# EAGLE design tdz (EAGLE 6.4)
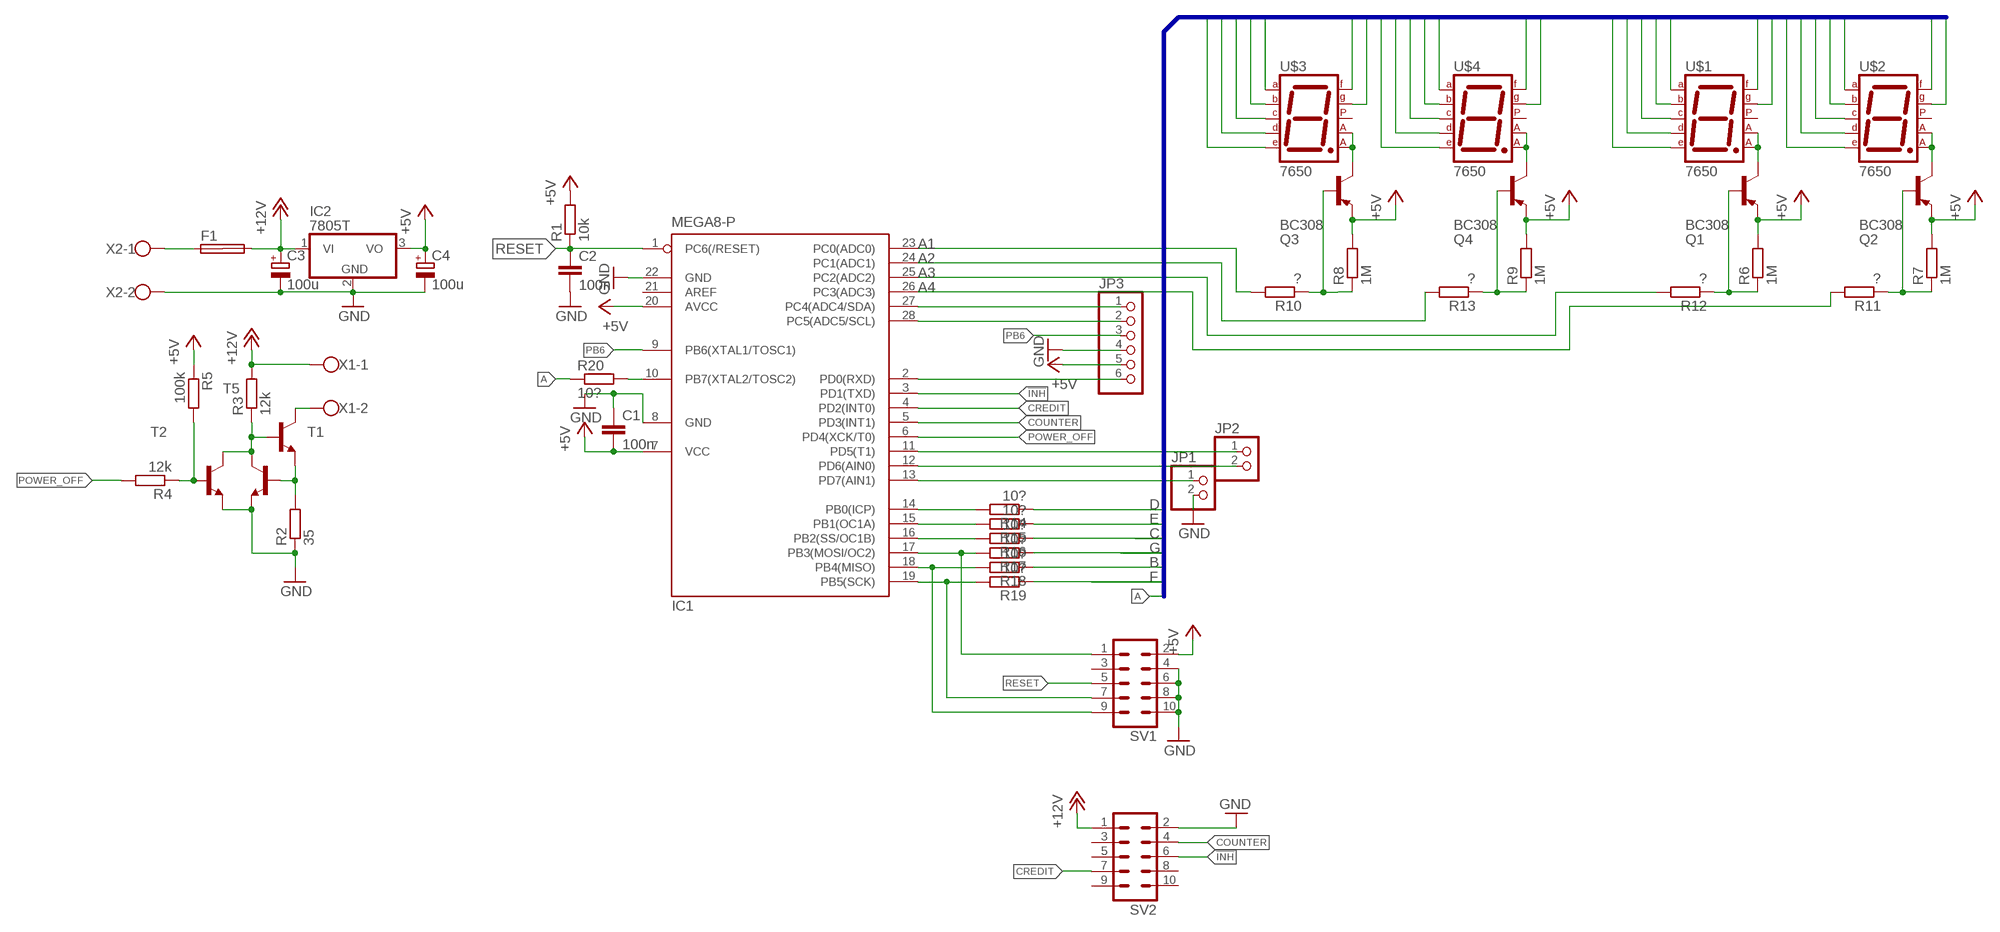
[diagram p0: schematic, sheet 1]

## Parts
C1  100n  C-EUC0603  [C0603]
C2  100n  C-EUC0603  [C0603]
C3  100u  CPOL-EUE22-9AXIAL  [E22-9]
C4  100u  CPOL-EUE22-9AXIAL  [E22-9]
F1  SHK20Q  [SHK20Q]
IC1  MEGA8-P  [DIL28-3]
IC2  7805T  [TO220H]
JP1  PINHD-1X02_2.54-S  [1X02-S]
JP2  PINHD-1X02_2.54-S  [1X02-S]
JP3  PINHD-1X6  [1X06]
Q1  BC308  BCX79  [TO92-EBC]
Q2  BC308  BCX79  [TO92-EBC]
Q3  BC308  BCX79  [TO92-EBC]
Q4  BC308  BCX79  [TO92-EBC]
R1  10k  R-EU_R0603  [R0603]
R2  35  R-EU_R0603  [R0603]
R3  12k  R-EU_R0603  [R0603]
R4  12k  R-EU_R0603  [R0603]
R5  100k  R-EU_R0603  [R0603]
R6  1M  R-EU_R0603  [R0603]
R7  1M  R-EU_R0603  [R0603]
R8  1M  R-EU_R0603  [R0603]
R9  1M  R-EU_R0603  [R0603]
R10  ?  R-EU_0207/7  [0207/7]
R11  ?  R-EU_0207/7  [0207/7]
R12  ?  R-EU_0207/7  [0207/7]
R13  ?  R-EU_0207/7  [0207/7]
R14  10?  R-EU_R0603  [R0603]
R15  10?  R-EU_R0603  [R0603]
R16  10?  R-EU_R0603  [R0603]
R17  10?  R-EU_R0603  [R0603]
R18  10?  R-EU_R0603  [R0603]
R19  10?  R-EU_R0603  [R0603]
R20  10?  R-EU_R0603  [R0603]
SV1  ML10L  [ML10L]
SV2  ML10L  [ML10L]
T1  BC548-NPN-TO92-CBE  [TO92-CBE]
T2  BC548-NPN-TO92-CBE  [TO92-CBE]
T5  BC548-NPN-TO92-CBE  [TO92-CBE]
U$1  7650  [7650]
U$2  7650  [7650]
U$3  7650  [7650]
U$4  7650  [7650]
X1  W237-102  [W237-102]
X2  W237-102  [W237-102]

## Nets
!INH!: IC1.3(PD1(TXD)) SV2.6
+5V: C1.2 C4.+ IC1.7(VCC) IC1.20(AVCC) IC2.3(VO) JP3.5 Q1.E Q2.E Q3.E Q4.E R1.2 R5.1 R6.2 R7.2 R8.2 R9.2 SV1.2
+12V: C3.+ F1.2A IC2.1(VI) R3.2 SV2.1 X1.1
A: R20.1 U$1.P$1(A) U$2.P$1(A) U$3.P$1(A) U$4.P$1(A)
A1: IC1.23(PC0(ADC0)) R10.2
A2: IC1.24(PC1(ADC1)) R13.2
A3: IC1.25(PC2(ADC2)) R12.2
A4: IC1.26(PC3(ADC3)) R11.2
B: R18.1 U$1.P$13(B) U$2.P$13(B) U$3.P$13(B) U$4.P$13(B)
C: R16.1 U$1.P$10(C) U$2.P$10(C) U$3.P$10(C) U$4.P$10(C)
COUNTER: IC1.5(PD3(INT1)) SV2.4
CREDIT: IC1.4(PD2(INT0)) SV2.7
D: R14.1 U$1.P$8(D) U$2.P$8(D) U$3.P$8(D) U$4.P$8(D)
E: R15.1 U$1.P$7(E) U$2.P$7(E) U$3.P$7(E) U$4.P$7(E)
F: R19.1 U$1.P$2(F) U$2.P$2(F) U$3.P$2(F) U$4.P$2(F)
G: R17.1 U$1.P$11(G) U$2.P$11(G) U$3.P$11(G) U$4.P$11(G)
GND: C1.1 C2.2 C3.- C4.- IC1.8(GND) IC1.22(GND) IC2.2(GND) JP1.2 JP3.4 R2.1 SV1.4 SV1.6 SV1.8 SV1.10 SV2.2 T1.E T2.E X2.2
N$1: Q1.C U$1.P$3(CA1) U$1.P$14(CA2)
N$2: Q2.C U$2.P$3(CA1) U$2.P$14(CA2)
N$3: Q3.C U$3.P$3(CA1) U$3.P$14(CA2)
N$4: Q4.C U$4.P$3(CA1) U$4.P$14(CA2)
N$5: Q4.B R9.1 R13.1
N$6: Q3.B R8.1 R10.1
N$7: Q2.B R7.1 R11.1
N$8: Q1.B R6.1 R12.1
N$9: T5.C X1.2
N$10: IC1.13(PD7(AIN1)) JP1.1
N$11: IC1.12(PD6(AIN0)) JP2.2
N$12: R2.2 T1.B T5.E
N$13: IC1.11(PD5(T1)) JP2.1
N$14: R3.1 T1.C T2.C T5.B
N$15: R4.1 R5.2 T2.B
N$142: IC1.10(PB7(XTAL2/TOSC2)) R20.2
N$143: IC1.14(PB0(ICP)) R14.2
N$144: IC1.15(PB1(OC1A)) R15.2
N$145: IC1.16(PB2(SS/OC1B)) R16.2
N$146: IC1.18(PB4(MISO)) R18.2 SV1.9
N$147: IC1.19(PB5(SCK)) R19.2 SV1.7
N$148: IC1.17(PB3(MOSI/OC2)) R17.2 SV1.1
N$149: IC1.27(PC4(ADC4/SDA)) JP3.1
N$150: IC1.28(PC5(ADC5/SCL)) JP3.2
N$151: IC1.2(PD0(RXD)) JP3.6
N$152: F1.1A X2.1
PB6: IC1.9(PB6(XTAL1/TOSC1)) JP3.3
POWER_OFF: IC1.6(PD4(XCK/T0)) R4.2
RESET: C2.1 IC1.1(PC6(/RESET)) R1.1 SV1.5
Unconnected: F1.1B F1.2B IC1.21(AREF) SV1.3 SV2.3 SV2.5 SV2.8 SV2.9 SV2.10 U$1.P$6(DP) U$2.P$6(DP) U$3.P$6(DP) U$4.P$6(DP)

## Buses
A,B,C,D,E,F,G

## Library data of the parts
C1 C2 = rcl:C-EU: CAPACITOR, European symbol
C3 C4 = rcl:CPOL-EU: POLARIZED CAPACITOR, European symbol
F1 = fuse:SHK20Q: FUSE HOLDER 5 x 20 mm, SH contact, E1207 Buerklin 64G6061
IC1 = atmel:MEGA8-P: MICROCONTROLLER 8 Kbytes FLASH, 1 kbytes SRAM, 512 bytes EEPROM, USART, 4-channel 10 bit ADC, 2-channel 8 bit ADC Pin compatible with Atmega48, ATMega88, ATMega168 Source: avr.lbr; OC_FARNELL: unknown; OC_NEWARK: unknown
IC2 = linear:78*: Positive VOLTAGE REGULATOR Source: http://cache.national.com/ds/LM/LM78L05.pdf http://www.fairchildsemi.com/ds/LM/LM7805.pdf
JP1 JP2 = pinhead-2:PINHD-1X02: PIN HEADER
JP3 = pinhead:PINHD-1X6: PIN HEADER
Q1-Q4 = transistor-pnp:BCX79*: PNP Transistror
R1-R20 = rcl:R-EU_: RESISTOR, European symbol
SV1 SV2 = con-harting-ml:ML10: HARTING; OC_FARNELL: unknown; OC_NEWARK: unknown
T1 T2 T5 = transistor:*-NPN-: NPN Transistror BF959 corrected 2008.03.06
U$1-U$4 = 7650:7650
X1 X2 = con-wago-500:W237-102: WAGO SCREW CLAMP

## Board
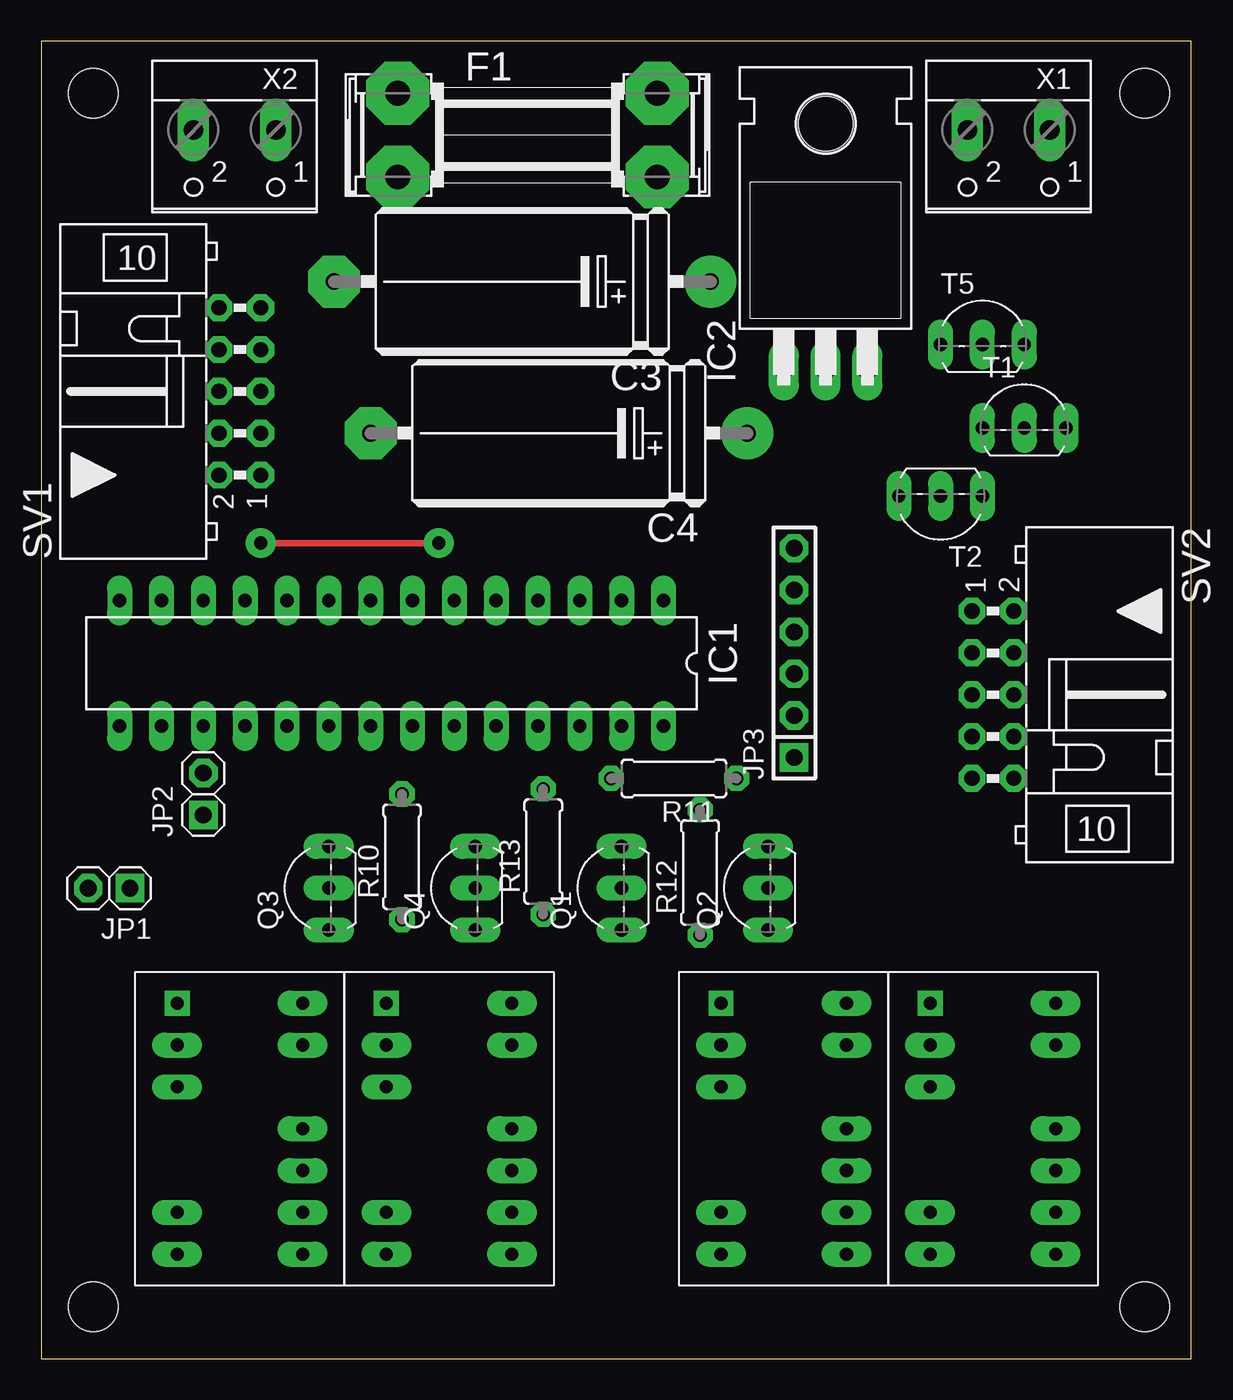
[diagram p1: board, top side]
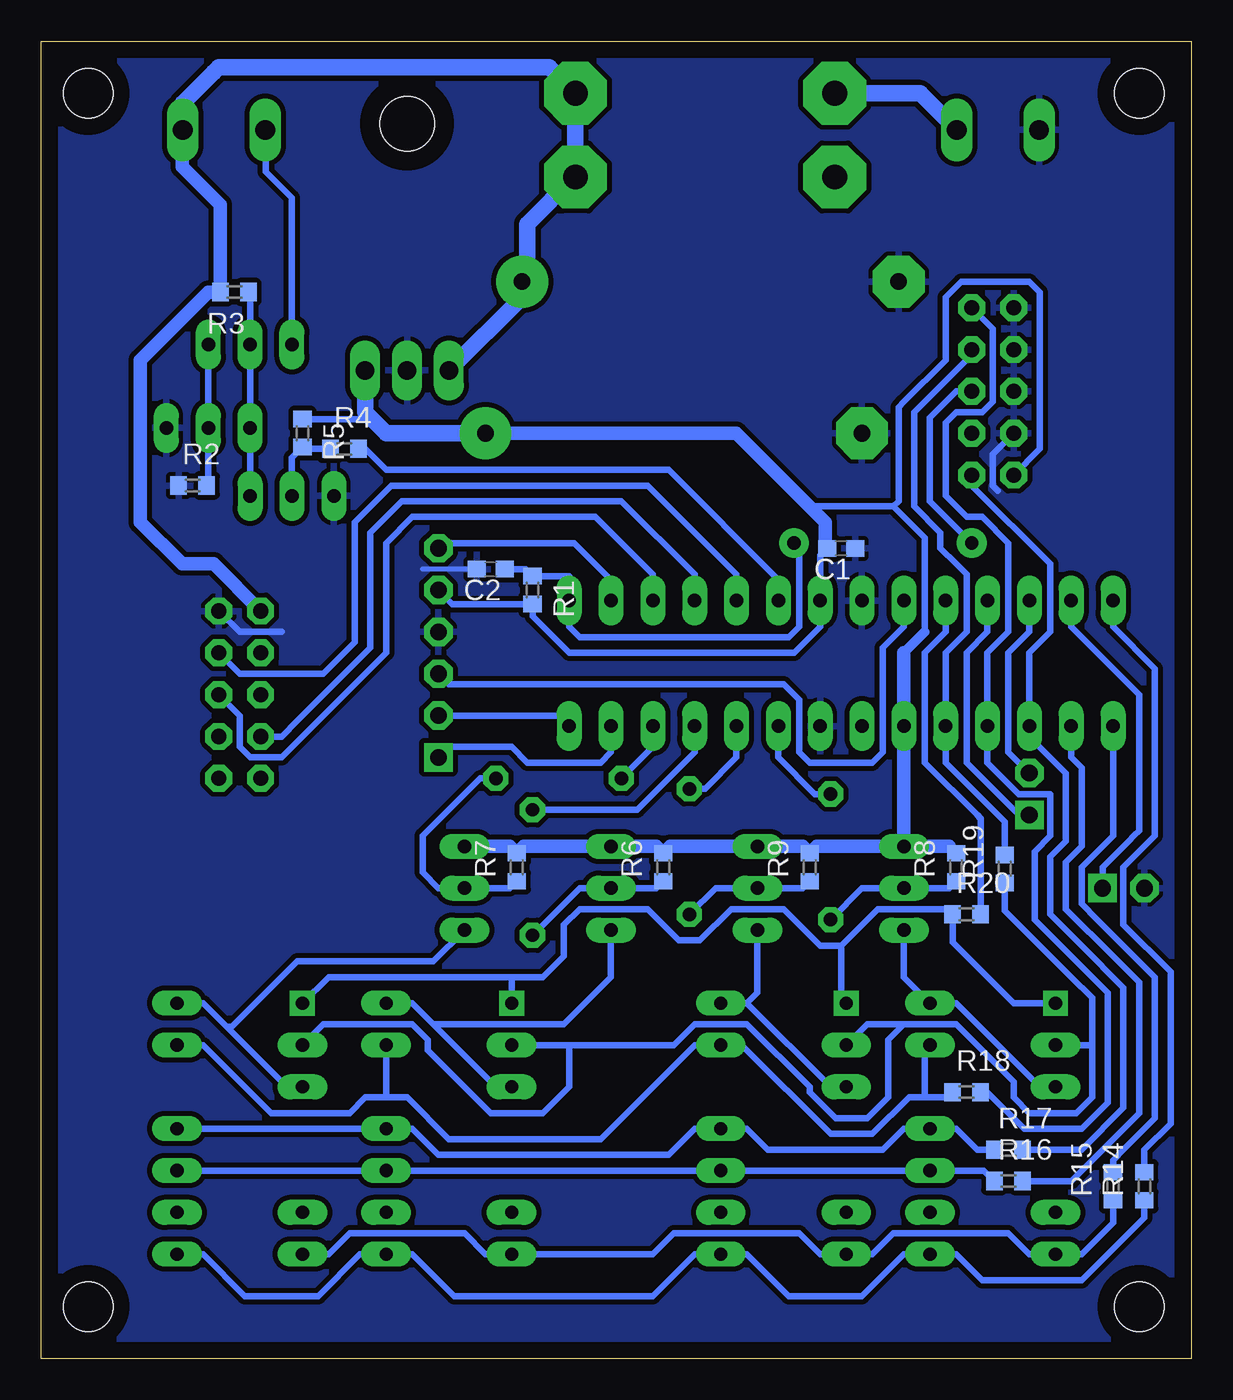
[diagram p2: board, bottom side, seen from below]

Size 69.84 x 80 mm. Coordinates in mm from the lower left corner, seen from the top.
Outline: 0,0 69.84,0 69.84,80 0,80 0,0
Copper layers (1*16): Top 0.035mm / dielectric 1.5mm / Bottom 0.035mm
Design rules "default *": minimum track width 10mil, minimum drill 24mil, track to track 12mil, track to pad 12mil, pad to pad 12mil, via to via 12mil, smd to smd 0mil, copper to edge 40mil, drill to drill 8mil, minimum pad ring 14mil, minimum via ring 20mil, stop-mask expansion 4mil, vias tented up to drill 0mil, thermal gap 10mil
Holes 3 mm at 3.17,76.83 3.17,3.17 66.99,3.17 66.99,76.83

### Footprints (pad centres in the part's own frame; a part is rotated, then mirrored left to right if it is on the bottom)
C0603 = smd 1.1 x 1: 1 -0.85,0; 2 0.85,0
E22-9 = drill 1.016 pad 3.15: + -11.43,0 | drill 1.016 pad 3.15 octagon: - 11.43,0
SHK20Q = drill 1.5 pad 3.81 octagon: 1A -7.874,2.54; 1B -7.874,-2.54; 2A 7.874,2.54; 2B 7.874,-2.54
DIL28-3 = drill 0.813 long: 1 -16.51,-3.81; 2 -13.97,-3.81; 3 -11.43,-3.81; 4 -8.89,-3.81; 5 -6.35,-3.81; 6 -3.81,-3.81; 7 -1.27,-3.81; 8 1.27,-3.81; 9 3.81,-3.81; 10 6.35,-3.81; 11 8.89,-3.81; 12 11.43,-3.81; 13 13.97,-3.81; 14 16.51,-3.81; 15 16.51,3.81; 16 13.97,3.81; 17 11.43,3.81; 18 8.89,3.81; 19 6.35,3.81; 20 3.81,3.81; 21 1.27,3.81; 22 -1.27,3.81; 23 -3.81,3.81; 24 -6.35,3.81; 25 -8.89,3.81; 26 -11.43,3.81; 27 -13.97,3.81; 28 -16.51,3.81
TO220H = drill 1.118 long: 1 -2.54,-10.16; 2 0,-10.16; 3 2.54,-10.16 | hole 3.302: 0,4.826
1X02-S = drill 1.016 square: 1 -1.27,0 | drill 1.016 octagon: 2 1.27,0
1X06 = drill 1.016 square: 1 -6.35,0 | drill 1.016 octagon: 2 -3.81,0; 3 -1.27,0; 4 1.27,0; 5 3.81,0; 6 6.35,0
TO92-EBC = drill 0.813 long: B 0,-1.27; C -2.54,-1.27; E 2.54,-1.27
R0603 = smd 1 x 1.1: 1 -0.85,0; 2 0.85,0
0207/7 = drill 0.813 octagon: 1 -3.81,0; 2 3.81,0
ML10L = drill 0.914 octagon: 1 -5.08,-1.27; 2 -5.08,1.27; 3 -2.54,-1.27; 4 -2.54,1.27; 5 0,-1.27; 6 0,1.27; 7 2.54,-1.27; 8 2.54,1.27; 9 5.08,-1.27; 10 5.08,1.27
TO92-CBE = drill 0.813 long: B 0,0; C -2.54,0; E 2.54,0
7650 = drill 0.8 square: P$1 -3.81,7.62 | drill 0.8 long: P$2 -3.81,5.08; P$3 -3.81,2.54; P$6 -3.81,-5.08; P$7 -3.81,-7.62; P$8 3.81,-7.62; P$9 3.81,-5.08; P$10 3.81,-2.54; P$11 3.81,0; P$13 3.81,5.08; P$14 3.81,7.62
W237-102 = drill 1.194 long: 1 -2.5,-1.27; 2 2.5,-1.27

### Placement (x,y rotation side)
C1  21.27,49.21 180 bottom
C2  42.55,47.94 180 bottom
C3  29.21,65.41 180 top
C4  31.43,56.2 180 top
F1  29.53,74.3 0 top
IC1  21.27,42.23 180 top
IC2  47.62,70.17 0 top
JP1  4.13,28.57 180 top
JP2  9.84,34.29 90 top
JP3  45.72,42.86 90 top
Q1  33.97,28.57 90 top
Q2  42.86,28.57 90 top
Q3  16.19,28.57 90 top
Q4  25.08,28.57 90 top
R1  40.01,46.67 270 bottom
R2  60.64,53.02 0 bottom
R3  58.1,64.77 180 bottom
R4  51.44,55.24 0 bottom
R5  53.98,56.2 270 bottom
R6  32.07,29.84 90 bottom
R7  40.96,29.84 90 bottom
R8  14.29,29.84 90 bottom
R9  23.18,29.84 90 bottom
R10  21.91,30.48 90 top
R11  38.42,35.24 180 top
R12  40.01,29.53 90 top
R13  30.48,30.8 90 top
R14  2.86,10.48 90 bottom
R15  4.76,10.48 90 bottom
R16  11.11,10.79 0 bottom
R17  11.11,12.7 0 bottom
R18  13.65,16.19 0 bottom
R19  11.34,29.75 90 bottom
R20  13.65,26.99 0 bottom
SV1  12.06,58.74 90 top
SV2  57.78,40.32 270 top
T1  59.69,56.52 0 top
T2  54.61,52.39 180 top
T5  57.15,61.59 0 top
U$1  45.09,13.97 0 top
U$2  57.78,13.97 0 top
U$3  12.06,13.97 0 top
U$4  24.77,13.97 0 top
X1  58.74,73.34 180 top
X2  11.75,73.34 180 top

### Tracks (layer width: path | path; a pad name or v marks a point on that pad's centre or on a via)
!INH!
  Bottom 0.406: IC1.3 32.7,47.62 36.2,51.12 47.31,51.12 48.9,49.53 48.9,42.86 53.34,38.42 55.24,36.51 57.15,36.51 57.78,37.15 57.78,39.05 SV2.6
+5V
  Bottom 0.406: R8.2 14.71,31.11 | 16.19,44.13 16.19,49.21 16.19,49.85 17.78,51.44 18.1,51.75 | 21.91,49.21 C1.2 22.54,48.79 IC1.7 22.54,44.45 24.13,42.86 37.78,42.86 40.01,45.09 R1.2 44.87,45.82 JP3.5 | R5.1 49.74,57.05 48.9,56.2 | SV1.2 9.21,55.24 9.21,64.77 9.84,65.41 13.97,65.41 14.92,64.45 14.92,60.64 17.46,58.1 17.78,57.78 17.78,52.07 18.1,51.75 | 18.1,51.75 22.86,51.75 23.02,51.59
  Bottom 0.61: 17.46,42.86 16.19,44.13
  Bottom 0.813: 14.71,31.11 Q3.E | Q3.E IC1.20 17.46,42.86 | Q2.E 41.38,31.11 R7.2 40.54,31.11 Q1.E 32.49,31.11 R6.2 31.65,31.11 Q4.E 23.6,31.11 R9.2 22.76,31.11 Q3.E | C4.+ 27.62,56.2 23.02,51.59 22.23,50.8 22.23,49.31 C1.2
  Bottom 1.016: C4.+ 48.9,56.2 50.16,57.47 IC2.3
+12V
  Bottom 0.406: 61.28,74.57 X1.1
  Bottom 0.813: 61.28,73.7 X1.1 61.24,76.24 | 61.28,74.57 61.28,72.71 61.28,72.39 58.95,70.06 R3.2 59.69,64.77 63.82,60.64 63.82,50.8 61.28,48.26 59.37,48.26 SV2.1 | 37.47,71.75 37.4,71.82
  Bottom 1.016: 61.24,76.24 59.37,78.11 59.05,78.42 38.99,78.42 F1.2A 37.4,71.82 | 37.47,71.75 40.32,68.9 40.32,65.72 C3.+ 40.64,64.45 IC2.1
A
  Bottom 0.406: U$1.P$1 41.27,22.86 | 41.27,22.86 41.27,23.18 | U$2.P$1 52.39,23.18 41.27,23.18 | 41.27,23.18 39.37,23.18 38.73,23.81 38.1,24.45 38.1,26.35 37.15,27.3 33.02,27.3 31.11,25.4 29.84,25.4 27.94,27.3 26.35,27.3 24.77,27.3 22.54,25.08 21.27,25.08 | 41.27,23.18 41.27,22.86 | 21.27,25.08 19.05,27.3 14.82,27.3 R20.1 14.5,25.3 14.29,25.08 10.79,21.59 U$3.P$1 | 21.27,25.08 21.27,21.91 U$4.P$1
A1
  Bottom 0.406: R10.2 22.86,34.29 25.08,36.51 IC1.23
A2
  Bottom 0.406: R13.2 29.53,34.61 27.62,36.51 IC1.24
A3
  Bottom 0.406: R12.2 33.66,33.34 30.16,36.83 IC1.25
A4
  Bottom 0.406: IC1.26 32.7,37.15 R11.2
B
  Bottom 0.406: U$2.P$13 60.01,19.05 55.88,14.92 51.12,14.92 50.16,15.88 48.9,15.88 | 16.19,15.88 17.14,15.88 19.37,13.65 21.91,13.65 27.3,19.05 U$4.P$13 30.16,19.05 35.88,13.34 41.59,13.34 45.09,13.34 47.62,15.88 48.9,15.88 | 16.19,15.88 16.19,18.73 U$3.P$13 | U$1.P$13 48.9,15.88 | 16.19,15.88 14.82,15.88 R18.1
C
  Bottom 0.406: U$2.P$10 U$1.P$10 U$4.P$10 U$3.P$10 12.6,11.43 R16.1
COUNTER
  Bottom 0.406: IC1.5 27.62,47.62 33.02,53.02 48.58,53.02 50.8,50.8 50.8,43.5 52.7,41.59 55.88,41.59 57.78,41.59 SV2.4
CREDIT
  Bottom 0.406: IC1.4 30.16,47.62 34.61,52.07 47.94,52.07 49.85,50.16 49.85,43.18 54.29,38.73 55.24,37.78 55.56,37.78 SV2.7
D
  Bottom 0.406: U$2.P$8 60.01,6.35 57.47,3.81 53.02,3.81 50.48,6.35 U$1.P$8 47.31,6.35 44.77,3.81 32.7,3.81 30.16,6.35 U$4.P$8 26.99,6.35 24.45,3.81 20,3.81 17.46,6.35 U$3.P$8 14.29,6.35 12.7,4.76 6.67,4.76 2.86,8.57 R14.1
E
  Bottom 0.406: U$2.P$7 52.39,6.35 51.12,7.62 44.13,7.62 42.86,6.35 U$1.P$7 32.7,6.35 31.43,7.62 23.81,7.62 22.54,6.35 U$4.P$7 19.37,6.35 18.1,7.62 17.46,7.62 16.83,7.62 11.11,7.62 9.84,6.35 U$3.P$7 6.67,6.35 4.76,8.26 R15.1
F
  Bottom 0.406: U$4.P$2 19.68,20.32 17.46,20.32 | 17.46,20.32 14.29,20.32 10.79,16.83 10.79,15.88 9.84,14.92 6.99,14.92 6.03,15.88 6.03,19.05 | 17.46,20.32 18.41,19.37 18.41,15.88 19.68,14.61 21.59,14.61 23.18,16.19 23.18,16.51 26.99,20.32 30.16,20.32 31.43,19.05 37.78,19.05 | 37.78,19.05 U$1.P$2 | U$2.P$2 52.7,20.32 47.31,20.32 46.35,19.37 46.35,18.73 42.55,14.92 39.37,14.92 37.78,16.51 37.78,19.05 | U$3.P$2 6.03,19.05 | 6.03,19.05 6.03,21.91 7.3,23.18 11.34,27.21 R19.1
G
  Bottom 0.406: U$2.P$11 U$1.P$11 47.31,13.97 45.72,12.38 31.75,12.38 30.16,13.97 U$4.P$11 26.99,13.97 25.72,12.7 18.73,12.7 17.46,13.97 U$3.P$11 14.29,13.97 13.02,12.7 R17.1
GND
  Bottom 0.305: C2.2 46.67,47.94
  Bottom 0.406: SV2.2 57.78,44.13 55.24,44.13 | SV1.4 12.06,54.93 12.06,53.02 11.75,52.7
  pour Bottom (isolate 0.305): -1.27,82.55 -1.27,-1.27 71.44,-1.27 71.44,82.55
N$1
  Bottom 0.406: U$1.P$3 42.23,16.51 46.04,20.32 | 46.04,20.32 47.31,21.59 U$1.P$14 | Q1.C 35.24,23.18 38.1,20.32 46.04,20.32
N$2
  Bottom 0.406: U$2.P$3 54.93,16.51 58.58,20.16 | 58.58,20.16 60.01,21.59 U$2.P$14 | Q2.C 46.04,24.13 53.98,24.13 54.29,24.13 58.26,20.16 58.58,20.16
N$3
  Bottom 0.406: U$3.P$3 9.21,16.51 14.29,21.59 U$3.P$14 17.46,23.18 Q3.C
N$4
  Bottom 0.406: U$4.P$3 21.91,16.51 26.99,21.59 | 26.99,21.59 U$4.P$14 | 26.99,21.59 26.35,22.23 Q4.C
N$5
  Bottom 0.406: R9.1 23.6,28.57 Q4.B 28.89,28.57 R13.1
N$6
  Bottom 0.406: R8.1 14.71,28.57 Q3.B 20,28.57 R10.1
N$7
  Bottom 0.406: R7.1 41.38,28.57 Q2.B 45.72,28.57 46.67,29.53 46.67,31.75 43.18,35.24 R11.1
N$8
  Bottom 0.406: R6.1 32.49,28.57 Q1.B 37.15,28.57 R12.1
N$9
  Bottom 0.406: T5.C 54.61,70.48 56.2,72.07 56.2,74.57 X1.2
N$10
  Bottom 0.406: JP1.1 5.4,29.84 3.81,31.43 3.49,31.75 3.17,32.07 3.17,40.32 7.3,44.45 IC1.13
N$11
  Bottom 0.406: IC1.12 9.84,44.13 11.11,42.86 11.11,36.83 JP2.2
N$12
  Bottom 0.406: R2.2 59.69,53.12 T1.B T5.E
N$13
  Bottom 0.406: IC1.11 12.38,44.13 13.65,42.86 13.65,37.15 13.65,36.75 13.65,36.2 10.48,33.02 JP2.1
N$14
  Bottom 0.406: T2.C T1.C T5.B 57.15,64.67 R3.1
N$15
  Bottom 0.406: R4.1 53.87,55.24 R5.2 54.61,54.71 T2.B
N$142
  Bottom 0.406: IC1.10 14.92,44.13 16.19,42.86 16.19,36.2 13.02,33.02 12.8,32.8 R20.2
N$143
  Bottom 0.406: R14.2 2.86,12.7 1.27,14.29 1.27,23.5 4.13,26.35 4.13,29.84 2.86,31.11 2.22,31.75 2.22,41.91 4.76,44.45 IC1.14
N$144
  Bottom 0.406: R15.2 4.76,12.06 4.13,12.7 2.22,14.61 2.22,23.18 5.08,26.04 5.71,26.67 6.67,27.62 6.67,29.84 5.71,30.8 4.76,31.75 IC1.15
N$145
  Bottom 0.406: R16.2 7.3,10.79 6.03,12.06 3.17,14.92 3.17,22.86 6.03,25.72 6.35,26.04 7.62,27.3 7.62,30.16 6.67,31.11 6.67,31.43 6.67,35.88 7.3,36.51 IC1.16
N$146
  Bottom 0.406: R18.2 12.38,16.19 10.16,13.97 6.67,13.97 5.08,15.56 5.08,22.23 6.51,23.65 6.99,24.13 9.53,26.67 9.53,30.8 8.57,31.75 8.57,34.29 10.48,34.29 12.38,36.2 IC1.18 12.38,42.86 11.11,44.13 11.11,49.53 12.7,51.12 13.65,51.12 14.92,52.39 14.92,56.83 14.29,57.47 12.7,57.47 12.06,58.1 12.06,62.55 SV1.9
N$147
  Bottom 0.406: R19.2 11.34,32.61 14.92,36.2 IC1.19 14.92,42.86 13.65,44.13 13.65,47.62 14.29,48.26 15.24,49.21 15.24,50.16 16.83,51.75 16.83,57.47 13.34,60.96 SV1.7
N$148
  Bottom 0.406: R17.2 6.67,12.7 4.13,15.24 4.13,22.54 6.67,25.08 8.57,26.99 8.57,30.48 7.94,31.11 7.62,31.43 7.62,35.56 9.84,37.78 IC1.17 9.84,39.69 9.84,42.86 8.57,44.13 8.57,48.26 13.34,53.02 SV1.1
N$149
  Bottom 0.406: IC1.27 35.24,36.83 35.88,36.2 40.32,36.2 41.27,37.15 45.09,37.15 JP3.1
N$150
  Bottom 0.406: IC1.28 38.42,39.05 JP3.2
N$151
  Bottom 0.406: IC1.2 35.24,47.31 37.47,49.53 43.5,49.53 45.4,49.53 JP3.6
N$152
  Bottom 1.016: X2.1 16.47,76.83 F1.1A
PB6
  Bottom 0.406: IC1.9 17.46,44.45 18.73,43.18 18.73,36.83 19.37,36.2 23.18,36.2 23.81,36.83 23.81,40.01 24.77,40.96 45.09,40.96 JP3.3
POWER_OFF
  Bottom 0.406: IC1.6 25.08,47.31 31.75,53.98 48.9,53.98 50.16,55.24 R4.2
RESET  (via drill 0.8)
  Top 0.406: v24.13,49.53 v13.34,49.53
  Bottom 0.406: 37.78,45.72 IC1.1 37.78,45.72 | v24.13,49.53 23.81,49.53 23.81,48.58 23.81,44.45 24.45,43.81 37.15,43.81 37.78,44.45 37.78,45.72 | 37.78,45.72 37.78,47.52 R1.1 40.42,47.94 C2.1 | v13.34,49.53 13.97,50.16 15.88,52.07 15.88,53.66 15.88,57.15 14.29,58.74 SV1.5

### Text on the board
Document: UP